# Altium project FMC_SDR_LFFE.PrjPcb (part 3 of 3)

## Sheet CarrierRecovery.SchDoc: Title
size 420 x 297 mm; CheckedBy: -; CompanyName: CERN; DrawnBy: DrawnBy; Organization: CERN; Address1: European Organization for Nuclear Research; Address2: CH-1211 Genčve 23 - Switzerland; DocumentNumber: 1; Revision: -; SheetNumber: 1; SheetTotal: 10; EDA_Number: EDA-XXXXX-VX-X; Projet: -; ModifiedBy: -; CreateDate: XX/XX/XXXX; CheckedDate: -; Title2: Title2; DivGrp: TE/MPE; Designer: Designer; ModifiedDate: -
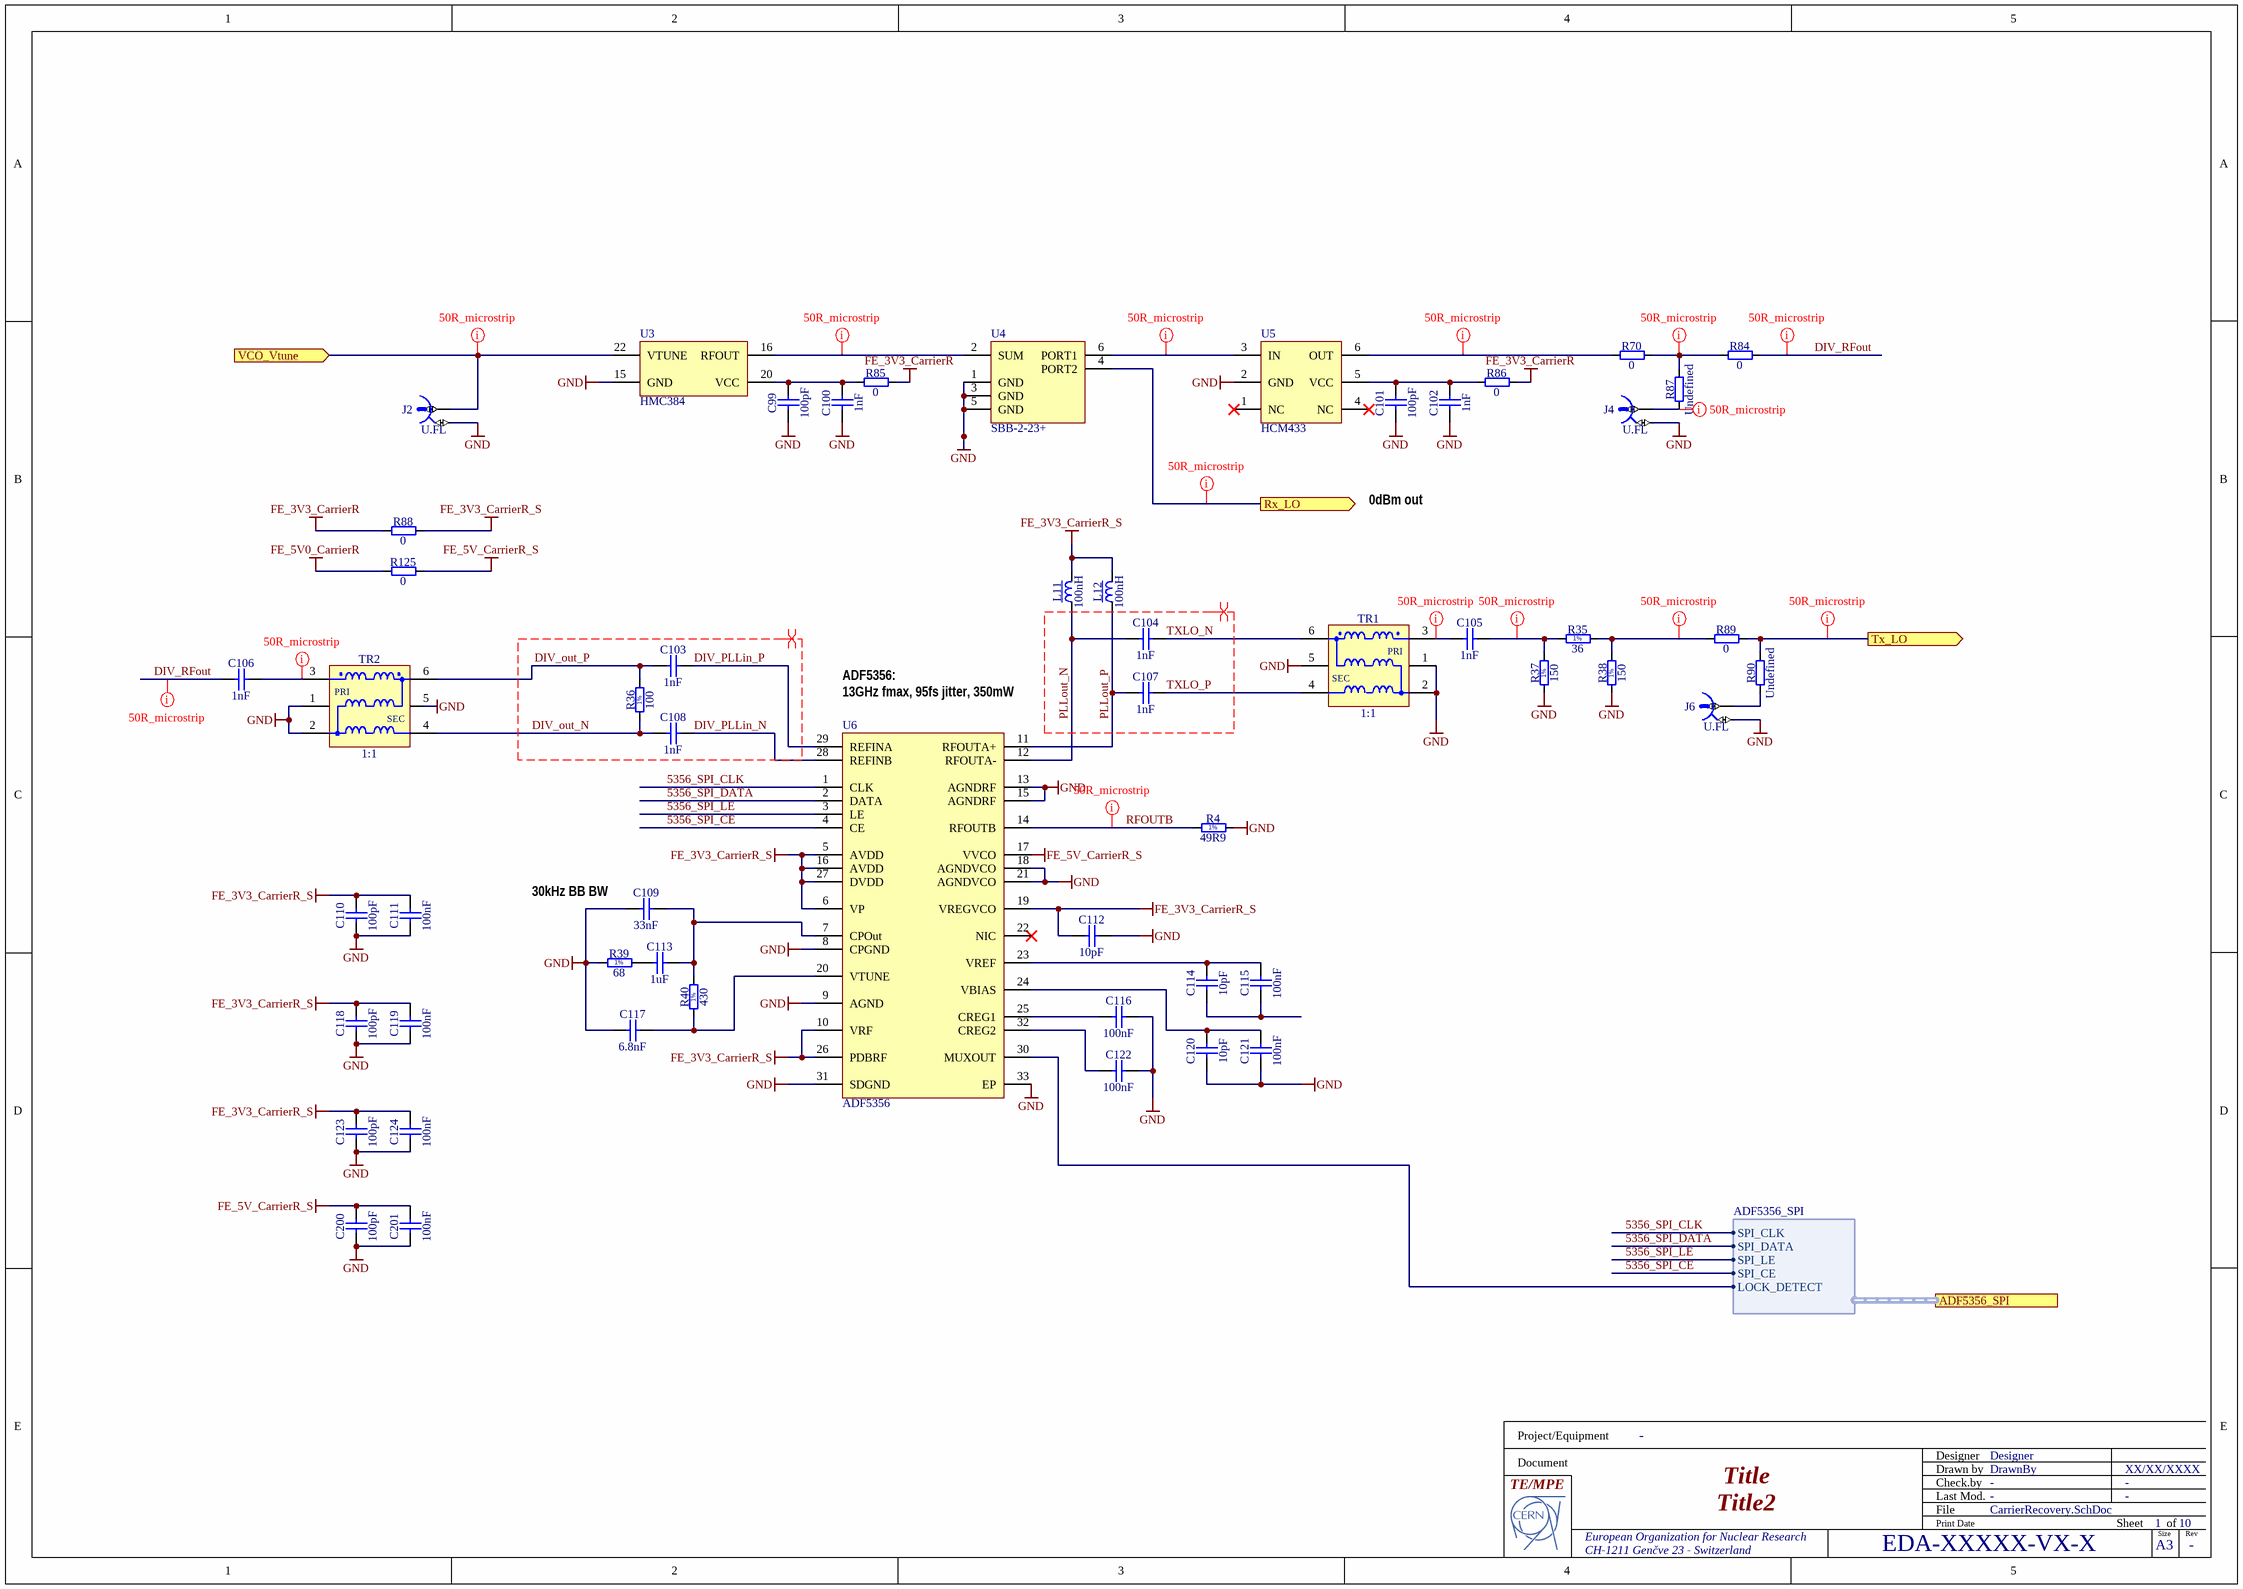
[diagram p9: CarrierRecovery.SchDoc]

### Parts
C99  100pF  [CAPC1005X55N]
C100  1nF  [CAPC1005X55N]
C101  100pF  [CAPC1005X55N]
C102  1nF  [CAPC1005X55N]
C103  1nF  [CAPC1005X55N]
C104  1nF  [CAPC1005X55N]
C105  1nF  [CAPC1005X55N]
C106  1nF  [CAPC1005X55N]
C107  1nF  [CAPC1005X55N]
C108  1nF  [CAPC1005X55N]
C109  33nF  [CAPC2012X135N]
C110  100pF  [CAPC1005X55N]
C111  100nF  [CAPC1005X55N]
C112  10pF  [CAPC1005X55N]
C113  1uF  [CAPC3216X140N]
C114  10pF  [CAPC1005X55N]
C115  100nF  [CAPC1005X55N]
C116  100nF  [CAPC1005X55N]
C117  6.8nF  [CAPC2012X135N]
C118  100pF  [CAPC1005X55N]
C119  100nF  [CAPC1005X55N]
C120  10pF  [CAPC1005X55N]
C121  100nF  [CAPC1005X55N]
C122  100nF  [CAPC1005X55N]
C123  100pF  [CAPC1005X55N]
C124  100nF  [CAPC1005X55N]
C200  100pF  [CAPC1005X55N]
C201  100nF  [CAPC1005X55N]
J2  U.FL  [HIROSE_U.FL-R-SMT-1(10)]
J4  U.FL  [HIROSE_U.FL-R-SMT-1(10)]
J6  U.FL  [HIROSE_U.FL-R-SMT-1(10)]
L11  100nH  [IND_COILCRAFT_0603HP]
L12  100nH  [IND_COILCRAFT_0603HP]
R4  49R9  [RESC1005X40N]
R35  36  [RESC1005X40N]
R36  100  [RESC1005X40N]
R37  150  [RESC1005X40N]
R38  150  [RESC1005X40N]
R39  68  [RESC1608X55N]
R40  430  [RESC1608X55N]
R70  0  [RESC1608X55N]
R84  0  [RESC1608X55N]
R85  0  [RESC1608X55N]
R86  0  [RESC1608X55N]
R87  Undefined  [RESC1608X55N]
R88  0  [RESC1608X55N]
R89  0  [RESC1608X55N]
R90  Undefined  [RESC1608X55N]
R125  0  [RESC1608X55N]
TR1  1:1  [XFMR_MINI-CIRCUITS_DB1627]
TR2  1:1  [XFMR_MINI-CIRCUITS_DB1627]
U3  HMC384  [HMC384]
U4  SBB-2-23+  [SBB-2-23]
U5  HCM433  [HMC433]
U6  ADF5356  [ADF3356]

### Ports
ADF5356_SPI (harness ADF5356_SPI), Rx_LO (out), Tx_LO (out), VCO_Vtune (in)

### Harnesses
ADF5356_SPI: SPI_CLK, SPI_DATA, SPI_LE, SPI_CE, LOCK_DETECT

### Nets
FE_3V3_CarrierR: R85.2 R86.2 R88.1
FE_3V3_CarrierR_S: C110.2 C111.2 C112.1 C118.2 C119.2 C123.2 C124.2 L11.2 L12.2 R88.2 U6.5(AVDD) U6.6(VP) U6.10(VRF) U6.16(AVDD) U6.19(VREGVCO) U6.26(PDBRF) U6.27(DVDD)
FE_5V0_CarrierR: R125.1
FE_5V_CarrierR_S: C200.2 C201.2 R125.2 U6.17(VVCO)
GND: C99.1 C100.1 C101.1 C102.1 C109.1 C110.1 C111.1 C112.2 C116.2 C117.1 C118.1 C119.1 C120.1 C121.1 C122.2 C123.1 C124.1 C200.1 C201.1 J2.2 J4.2 J6.2 R4.2 R37.1 R38.1 R39.1 TR1.1(NC) TR1.2(P1) TR1.5(NC) TR2.1(NC) TR2.2(P1) TR2.5(NC) U3.15(GND) U4.1(GND) U4.3(GND) U4.5(GND) U5.2(GND) U6.8(CPGND) U6.9(AGND) U6.13(AGNDRF) U6.15(AGNDRF) U6.18(AGNDVCO) U6.21(AGNDVCO) U6.31(SDGND) U6.33(EP)
5356_SPI_CE: U6.4(CE) ; port ADF5356_SPI.SPI_CE
5356_SPI_CLK: U6.1(CLK) ; port ADF5356_SPI.SPI_CLK
5356_SPI_DATA: U6.2(DATA) ; port ADF5356_SPI.SPI_DATA
5356_SPI_LE: U6.3(LE) ; port ADF5356_SPI.SPI_LE
DIV_out_N: C108.1 R36.1 TR2.4(S1)
DIV_out_P: C103.1 R36.2 TR2.6(S1)
DIV_PLLin_N: C108.2 U6.28(REFINB)
DIV_PLLin_P: C103.2 U6.29(REFINA)
DIV_RFout: C106.1 R84.2
LOCK_DETECT: U6.30(MUXOUT) ; port ADF5356_SPI.LOCK_DETECT
PLLout_N: C104.1 L11.1 U6.12(RFOUTA-)
PLLout_P: C107.1 L12.1 U6.11(RFOUTA+)
RFOUTB: R4.1 U6.14(RFOUTB)
RX_LO: U4.4(PORT2) ; port Rx_LO
TX_LO: R89.2 R90.2 ; port Tx_LO
TXLO_N: C104.2 TR1.6(S1)
TXLO_P: C107.2 TR1.4(S1)
VCO_Vtune: J2.1 U3.22(VTUNE) ; port VCO_Vtune
NetC99_2: C99.2 C100.2 R85.1 U3.20(VCC)
NetC101_2: C101.2 C102.2 R86.1 U5.5(VCC)
NetC105_1: C105.1 TR1.3(P1)
NetC105_2: C105.2 R35.1 R37.2
NetC106_2: C106.2 TR2.3(P1)
NetC109_2: C109.2 C113.2 R40.2 U6.7(CPOut)
NetC113_1: C113.1 R39.2
NetC114_1: C114.1 C115.1
NetC114_2: C114.2 C115.2 U6.23(VREF)
NetC116_1: C116.1 U6.25(CREG1)
NetC117_2: C117.2 R40.1 U6.20(VTUNE)
NetC120_2: C120.2 C121.2 U6.24(VBIAS)
NetC122_1: C122.1 U6.32(CREG2)
NetJ4_1: J4.1 R87.1
NetJ6_1: J6.1 R90.1
NetR35_2: R35.2 R38.2 R89.1
NetR70_1: R70.1 U5.6(OUT)
NetR70_2: R70.2 R84.1 R87.2
NetU3_16: U3.16(RFOUT) U4.2(SUM)
NetU4_6: U4.6(PORT1) U5.3(IN)

Not connected (* = marked no-connect by the designer): U5 1(NC)* 4(NC)*; U6 22(NIC)*

### Layout directives
net class 50R_class: DIV_RFout, NetC105_1, NetC105_2, NetC106_2, NetJ4_1, NetR35_2, NetR70_1, NetR70_2, NetU3_16, NetU4_6, RFOUTB, RX_LO, TX_LO, VCO_Vtune
differential pair; differential pair class 100R_diff: DIV_out_N, DIV_out_P, DIV_PLLin_N, DIV_PLLin_P, PLLout_N, PLLout_P, TXLO_N, TXLO_P

### Notes on the sheet
- 0dBm out
- (near R35) -6dB
- (near U6) ADF5356:
  13GHz fmax, 95fs jitter, 350mW
- (near C109) 30kHz BB BW
- Project/Equipment
- Document
- Designer
- Drawn by
- Check.by
- File
- Last Mod.
- Print Date
- Sheet
- Size
- A3
- of
- Rev
- (in symbol R0402_36R_1%_0.0625W_100PPM) 1%
- (in symbol R0402_49R9_1%_0.0625W_100PPM) 1%
- (in symbol R0402_100R_1%_0.0625W_100PPM) 1%
- (in symbol R0402_150R_1%_0.0625W_100PPM) 1%
- (in symbol R0603_68R_1%_0.1W_100PPM) 1%
- (in symbol R0603_430R_1%_0.1W_100PPM) 1%
- (in symbol XFMR_MINI-CIRCUITS_TCM1-63AX+) PRI; SEC

### Library data of the parts
C99 C101 C110 C118 C123 C200 = CC0402_100PF_50V_5%_C0G: Non-polarised capacitor; Part Description: SMD Multilayer Chip Ceramic Capacitor; Manufacturer: GENERIC; Manufacturer1 Part Number: C0402C101J5GACTU; Voltage: 50V; TC: C0G/NP0; Tolerance: ±5%; Part Number: CC0402_100PF_50V_5%_C0G; Component Kind: Standard; Component Type: Standard; Pin Count: 2; Value: 100pF; Status: Preferred; Manufacturer Part Number: CC0402_100PF_50V_5%_C0G; Case: 0402; Mounted: Yes; Socket: No; SMD: Yes; Sense: No; Manufacturer1 Example: KEMET; Manufacturer1 ComponentHeight: 0.55mm; HelpURL: \\cern.ch\dfs\Applications\Altium\Datasheets\CC0805_C0G_KEMET_(Commercial Grade).pdf; Author: CERN DEM JLC; CreateDate: 03.12.2007; LatestRevisionDate: 22.04.2015
C100 C102-C108 = CC0402_1NF_50V_10%_X7R: Non-polarised capacitor; Part Description: SMD Multilayer Chip Ceramic Capacitor; Manufacturer: GENERIC; Manufacturer1 Part Number: 223858715623; Voltage: 50V; TC: X7R; Tolerance: ±10%; Part Number: CC0402_1NF_50V_10%_X7R; Component Kind: Standard; Component Type: Standard; Pin Count: 2; Value: 1nF; Status: Not Recommended; Manufacturer Part Number: CC0402_1NF_50V_10%_X7R; Case: 0402; Mounted: Yes; Socket: No; SMD: Yes; Sense: No; Manufacturer1 Example: PHYCOMP; Manufacturer1 ComponentHeight: 0.55mm; HelpURL: \\cern.ch\dfs\Applications\Altium\Datasheets\CC0402_X7R_PHYCOMP.pdf; Author: CERN DEM JLC; CreateDate: 03.12.2007; LatestRevisionDate: 03.12.2007
C109 = CC0805_33NF_25V_10%_X7R: Non-polarised capacitor; Part Description: SMD Multilayer Chip Ceramic Capacitor; Manufacturer: GENERIC; Manufacturer1 Part Number: 223891015643; Voltage: 25V; TC: X7R; Tolerance: ±10%; Part Number: CC0805_33NF_25V_10%_X7R; Component Kind: Standard; Component Type: Standard; Pin Count: 2; Value: 33nF; Status: Preferred; Manufacturer Part Number: CC0805_33NF_25V_10%_X7R; Case: 0805; Mounted: Yes; Socket: No; SMD: Yes; Sense: No; Manufacturer1 Example: PHYCOMP; Manufacturer1 ComponentHeight: 1.35mm; HelpURL: \\cern.ch\dfs\Applications\Altium\Datasheets\CC0805_X7R_PHYCOMP.pdf; Author: CERN DEM JLC; CreateDate: 03.12.2007; LatestRevisionDate: 03.12.2007
C111 C115 C116 C119 C121 C122 C124 C201 = CC0402_100NF_50V_10%_X7R: Non-polarised capacitor; Part Description: SMD Multilayer Chip Ceramic Capacitor; Manufacturer: GENERIC; Manufacturer1 Part Number: GRM155R71H104KE14D; Voltage: 50V; TC: X7R; Tolerance: ±10%; Part Number: CC0402_100NF_50V_10%_X7R; Component Kind: Standard; Component Type: Standard; Pin Count: 2; Value: 100nF; Status: None; Manufacturer Part Number: CC0402_100NF_50V_10%_X7R; Case: 0402; Mounted: Yes; Socket: No; SMD: Yes; Sense: No; Manufacturer1 Example: MURATA; Manufacturer1 ComponentHeight: 0.55mm; HelpURL: \\cern.ch\dfs\Applications\Altium\Datasheets\CC0402_MURATA_GRM155R71H104KE14D.pdf; Author: CERN DEM MR; CreateDate: 30.06.2017; LatestRevisionDate: 30.06.2017
C112 C114 C120 = CC0402_10PF_50V_5%_C0G: Non-polarised capacitor; Part Description: SMD Multilayer Chip Ceramic Capacitor; Manufacturer: GENERIC; Manufacturer1 Part Number: C0402C100J5GACTU; Voltage: 50V; TC: C0G/NP0; Tolerance: ±5%; Part Number: CC0402_10PF_50V_5%_C0G; Component Kind: Standard; Component Type: Standard; Pin Count: 2; Value: 10pF; Status: Preferred; Manufacturer Part Number: CC0402_10PF_50V_5%_C0G; Case: 0402; Mounted: Yes; Socket: No; SMD: Yes; Sense: No; Manufacturer1 Example: KEMET; Manufacturer1 ComponentHeight: 0.55mm; HelpURL: \\cern.ch\dfs\Applications\Altium\Datasheets\CC0805_C0G_KEMET_(Commercial Grade).pdf; Author: CERN DEM JLC; CreateDate: 03.12.2007; LatestRevisionDate: 22.04.2015
C113 = CC1206_1UF_25V_10%_X7R: Non-polarised capacitor; Part Description: SMD Multilayer Chip Ceramic Capacitor; Manufacturer: GENERIC; Manufacturer1 Part Number: C1206C105K3RAC; Voltage: 25V; TC: X7R; Tolerance: ±10%; Part Number: CC1206_1UF_25V_10%_X7R; Component Kind: Standard; Component Type: Standard; Pin Count: 2; Value: 1uF; Status: Preferred; Manufacturer Part Number: CC1206_1UF_25V_10%_X7R; Case: 1206; Mounted: Yes; Socket: No; SMD: Yes; Sense: No; Manufacturer1 Example: KEMET; Manufacturer1 ComponentHeight: 1.75mm; HelpURL: \\cern.ch\dfs\Applications\Altium\Datasheets\CC1206_X7R_KEMET.pdf; Author: CERN DEM JLC; CreateDate: 03.12.2007; LatestRevisionDate: 03.12.2007
C117 = CC0805_6.8NF_50V_10%_X7R: Non-polarised capacitor; Part Description: SMD Multilayer Chip Ceramic Capacitor; Manufacturer: GENERIC; Manufacturer1 Part Number: 223858615634; Voltage: 50V; TC: X7R; Tolerance: ±10%; Part Number: CC0805_6.8NF_50V_10%_X7R; Component Kind: Standard; Component Type: Standard; Pin Count: 2; Value: 6.8nF; Status: Preferred; Manufacturer Part Number: CC0805_6.8NF_50V_10%_X7R; Case: 0805; Mounted: Yes; Socket: No; SMD: Yes; Sense: No; Manufacturer1 Example: PHYCOMP; Manufacturer1 ComponentHeight: 1.35mm; HelpURL: \\cern.ch\dfs\Applications\Altium\Datasheets\CC0805_X7R_PHYCOMP.pdf; Author: CERN DEM JLC; CreateDate: 03.12.2007; LatestRevisionDate: 03.12.2007
J2 J4 J6 = HIROSE_U.FL-R-SMT-1(10): Part Description: Up to 6GHz Ultra Small Surface Mount Male Coaxial Connectors U.FL Series; Manufacturer: HIROSE (HRS); PressFit: No; Part Number: HIROSE_U.FL-R-SMT-1(10); Component Kind: Standard; Component Type: Standard; Pin Count: 2; Family: U.FL; Mounted: Yes; Socket: No; SMD: Yes; Sense: No; Status: None; Manufacturer Part Number: U.FL-R-SMT-1(10); ComponentHeight: 1.25mm; HelpURL: \\cern.ch\dfs\Applications\Altium\Datasheets\HIROSE_U.FL-R-SMT-1(10).pdf; Author: CERN DEM JLC; CreateDate: 24.03.2010; LatestRevisionDate: 24.03.2010
L11 L12 = IND0603_100NH_2%_COILCRAFT_0603HP-R10XGLU: Inductor With Core; Part Description: Ceramic Chip Inductor; Power: 470mA; Resistance: 0.54R; Tolerance: ±2%; Part Number: IND0603_100NH_2%_COILCRAFT_0603HP-R10XGLU; Component Kind: Standard; Component Type: Standard; Pin Count: 2; Value: 100nH; Status: None; Manufacturer: COILCRAFT; Manufacturer Part Number: 0603HP-R10XGLU; Case: 0603; Mounted: Yes; Socket: No; SMD: Yes; Sense: No; ComponentHeight: 0.94mm; HelpURL: \\cern.ch\dfs\Applications\Altium\Datasheets\IND0603_COILCRAFT_0603HP.pdf; Author: CERN DEM JLC; CreateDate: 09.02.2017; LatestRevisionDate: 09.02.2017
R4 = R0402_49R9_1%_0.0625W_100PPM: Resistor - 1%; Part Description: General Purpose Thick Film Chip Resistor; Manufacturer: GENERIC; Manufacturer1 Part Number: 232270674999L or RC0402FR-0749R9L; TC: ±100ppm/°C; PressFit: No; Part Number: R0402_49R9_1%_0.0625W_100PPM; Component Kind: Standard; Component Type: Standard; Pin Count: 2; Value: 49R9; Status: Not Recommended; Power: 0.0625W; Tolerance: ±1%; Manufacturer Part Number: R0402_49R9_1%_0.0625W_100PPM; Case: 0402; Mounted: Yes; Sense: No; Socket: No; SMD: Yes; Manufacturer1 Example: YAGEO PHYCOMP; Manufacturer1 ComponentHeight: 0.4mm; HelpURL: \\cern.ch\dfs\Applications\Altium\Datasheets\R0402_Phycomp_RC0402.pdf; Author: CERN DEM JLC; CreateDate: 24.10.2012; LatestRevisionDate: 24.10.2012
R35 = R0402_36R_1%_0.0625W_100PPM: Resistor - 1%; Part Description: General Purpose Thick Film Chip Resistor; Manufacturer: GENERIC; Manufacturer1 Part Number: 232270673609L; TC: ±100ppm/°C; PressFit: No; Part Number: R0402_36R_1%_0.0625W_100PPM; Component Kind: Standard; Component Type: Standard; Pin Count: 2; Value: 36; Status: Not Recommended; Power: 0.0625W; Tolerance: ±1%; Manufacturer Part Number: R0402_36R_1%_0.0625W_100PPM; Case: 0402; Mounted: Yes; Sense: No; Socket: No; SMD: Yes; Manufacturer1 Example: YAGEO PHYCOMP; Manufacturer1 ComponentHeight: 0.4mm; HelpURL: \\cern.ch\dfs\Applications\Altium\Datasheets\R0402_Phycomp_RC0402.pdf; Author: CERN DEM JLC; CreateDate: 03.12.2007; LatestRevisionDate: 17.10.2012
R36 = R0402_100R_1%_0.0625W_100PPM: Resistor - 1%; Part Description: General Purpose Thick Film Chip Resistor; Manufacturer: GENERIC; Manufacturer1 Part Number: 232270671001L; TC: ±100ppm/°C; PressFit: No; Part Number: R0402_100R_1%_0.0625W_100PPM; Component Kind: Standard; Component Type: Standard; Pin Count: 2; Value: 100; Status: Not Recommended; Power: 0.0625W; Tolerance: ±1%; Manufacturer Part Number: R0402_100R_1%_0.0625W_100PPM; Case: 0402; Mounted: Yes; Sense: No; Socket: No; SMD: Yes; Manufacturer1 Example: YAGEO PHYCOMP; Manufacturer1 ComponentHeight: 0.4mm; HelpURL: \\cern.ch\dfs\Applications\Altium\Datasheets\R0402_Phycomp_RC0402.pdf; Author: CERN DEM JLC; CreateDate: 03.12.2007; LatestRevisionDate: 17.10.2012
R37 R38 = R0402_150R_1%_0.0625W_100PPM: Resistor - 1%; Part Description: General Purpose Thick Film Chip Resistor; Manufacturer: GENERIC; Manufacturer1 Part Number: 232270671501L; TC: ±100ppm/°C; PressFit: No; Part Number: R0402_150R_1%_0.0625W_100PPM; Component Kind: Standard; Component Type: Standard; Pin Count: 2; Value: 150; Status: Not Recommended; Power: 0.0625W; Tolerance: ±1%; Manufacturer Part Number: R0402_150R_1%_0.0625W_100PPM; Case: 0402; Mounted: Yes; Sense: No; Socket: No; SMD: Yes; Manufacturer1 Example: YAGEO PHYCOMP; Manufacturer1 ComponentHeight: 0.4mm; HelpURL: \\cern.ch\dfs\Applications\Altium\Datasheets\R0402_Phycomp_RC0402.pdf; Author: CERN DEM JLC; CreateDate: 03.12.2007; LatestRevisionDate: 17.10.2012
R39 = R0603_68R_1%_0.1W_100PPM: Resistor - 1%; Part Description: General Purpose Thick Film Chip Resistor; Manufacturer: GENERIC; Manufacturer1 Part Number: NRC06F68R0TRF; Power: 0.1W; TC: ±100ppm/°C; PressFit: No; Part Number: R0603_68R_1%_0.1W_100PPM; Component Kind: Standard; Component Type: Standard; Pin Count: 2; Value: 68; Status: Preferred; Tolerance: ±1%; Manufacturer Part Number: R0603_68R_1%_0.1W_100PPM; Case: 0603; Mounted: Yes; Sense: No; Socket: No; SMD: Yes; Manufacturer1 Example: NIC COMPONENT; Manufacturer1 ComponentHeight: 0.55mm; HelpURL: \\cern.ch\dfs\Applications\Altium\Datasheets\R0603_NIC_NRC.pdf; Author: CERN DEM JLC; CreateDate: 03.12.2007; LatestRevisionDate: 13.03.2008
R40 = R0603_430R_1%_0.1W_100PPM: Resistor - 1%; Part Description: General Purpose Thick Film Chip Resistor; Manufacturer: GENERIC; Manufacturer1 Part Number: NRC06F4300TRF; Power: 0.1W; TC: ±100ppm/°C; PressFit: No; Part Number: R0603_430R_1%_0.1W_100PPM; Component Kind: Standard; Component Type: Standard; Pin Count: 2; Value: 430; Status: Preferred; Tolerance: ±1%; Manufacturer Part Number: R0603_430R_1%_0.1W_100PPM; Case: 0603; Mounted: Yes; Sense: No; Socket: No; SMD: Yes; Manufacturer1 Example: NIC COMPONENT; Manufacturer1 ComponentHeight: 0.55mm; HelpURL: \\cern.ch\dfs\Applications\Altium\Datasheets\R0603_NIC_NRC.pdf; Author: CERN DEM JLC; CreateDate: 03.12.2007; LatestRevisionDate: 13.03.2008
R70 R84-R86 R88 R89 R125 = R0603_0R_JUMPER: Resistor; Part Description: 1A (0.05R Max DC Resistance) Zero Ohm Jumper; Manufacturer: GENERIC; Manufacturer1 Part Number: NRC06Z0; PressFit: No; Part Number: R0603_0R_JUMPER; Component Kind: Standard; Component Type: Standard; Pin Count: 2; Value: 0; Status: Preferred; Manufacturer Part Number: R0603_0R_JUMPER; Case: 0603; Mounted: Yes; Sense: No; Socket: No; SMD: Yes; Manufacturer1 Example: NIC COMPONENT; Manufacturer1 ComponentHeight: 0.55mm; HelpURL: \\cern.ch\dfs\Applications\Altium\Datasheets\R0603_NIC_NRC.pdf; Author: CERN DEM JLC; CreateDate: 03.12.2007; LatestRevisionDate: 13.03.2008
R87 R90 = R0603_NO-VALUE: Resistor; Part Description: Reserved Footprint For a 0603 (1608) Chip Resistor; PressFit: No; Mounted: No; Part Number: R0603_NO-VALUE; Component Kind: Standard; Component Type: Standard; Pin Count: 2; Value: Undefined; Status: None; Manufacturer: Undefined; Manufacturer Part Number: R0603_NO-VALUE; Case: 0603; Sense: No; Socket: No; SMD: Yes; Manufacturer1 Example: Undefined; Manufacturer1 Part Number: Undefined; Manufacturer1 ComponentHeight: Undefined; HelpURL: Undefined; Author: CERN DEM JLC; CreateDate: 03.12.2007; LatestRevisionDate: 13.03.2008
TR1 TR2 = XFMR_MINI-CIRCUITS_TCM1-63AX+: 50 Ohms 10  to 6000MHz RF Transformer; Power: 0.2W; Part Number: XFMR_MINI-CIRCUITS_TCM1-63AX+; Component Kind: Standard; Component Type: Standard; Pin Count: 6; Value: 1:1; Status: None; Part Description: 50 Ohms 10  to 6000MHz RF Transformer; Manufacturer: MINI-CIRCUITS; Manufacturer Part Number: TCM1-63AX+; Mounted: Yes; Socket: No; Sense: No; SMD: Yes; ComponentHeight: 4.06mm; HelpURL: \\cern.ch\dfs\Applications\Altium\Datasheets\XFMR_MINI-CIRCUITS_TCM1-63AX+.pdf; Author: CERN DEM MR; CreateDate: 08.02.2019; LatestRevisionDate: 08.02.2019

## Nets that join several sheets
FE_3V3_CarrierR: FrontEnd_PS (C130.2 R91.1 R96.2), CarrierRecovery (R85.2 R86.2 R88.1)
FE_3V3_Rx: FrontEnd_PS (C139.2 R99.1 R101.2), QPL9065 (R3.1 R61.1 R63.1)
FE_3V3_SW: FrontEnd (C13.2 C14.2 OSC1.4), FrontEnd_PS (C189.2 R102.1 R107.2), TDDswitches (6 pins)
FE_5V0_CarrierR: FrontEnd_PS (R147.2), CarrierRecovery (R125.1)
FE_5V0_Preamp: FrontEnd_PS (R115.2), TXpreamp (C174.2 C175.2 C176.2 L23.2)
FE_5V5: FrontEnd_PS (5 pins), LTM8032_5V5 (17 pins)
FE_PA_BIAS: FrontEnd_PS (R105.2), TGA2237orHMC453 (R73.1)
FE_PA_VDD: LTM8056 (22 pins), TGA2237orHMC453 (R77.2 R82.2)
FMC_3V3_IN: FrontEnd (BSC18.1), FrontEnd_PS (6 pins)
FMC_12V_IN: FrontEnd (BSC19.1), FrontEnd_PS (R103.1 R126.1)
GND: FrontEnd (17 pins), FrontEnd_PS (21 pins), LTM8032_5V5 (46 pins), LTM8032_3V8 (46 pins), QPL9065 (12 pins), TGA2237orHMC453 (14 pins), TXpreamp (C174.1 C175.1 C176.1 U12.2), TDDswitches (20 pins), CarrierRecovery (45 pins)
PA_GND: FrontEnd_PS (20 pins), LTM8056 (89 pins), QPL9065 (J8.2 J9.2), TGA2237orHMC453 (24 pins)
5356_SPI_CE: FrontEnd (BSC13.1), CarrierRecovery (U6.4)
5356_SPI_CLK: FrontEnd (BSC8.1), CarrierRecovery (U6.1)
5356_SPI_DATA: FrontEnd (BSC10.1), CarrierRecovery (U6.2)
5356_SPI_LE: FrontEnd (BSC11.1), CarrierRecovery (U6.3)
CR_NSHDN: FrontEnd (BSC12.1), FrontEnd_PS (R131.1 R149.1)
FE_NSHDN_DEEP: FrontEnd (BSC17.1), FrontEnd_PS (R129.1)
FE_TxAmpCPL: FrontEnd (R41.1 R43.2), TGA2237orHMC453 (IC6.3)
LNA_PD: FrontEnd (BSC15.1), QPL9065 (R49.1)
LOCK_DETECT: FrontEnd (BSC20.1), CarrierRecovery (U6.30)
NetC1_2: FrontEnd_PS (R95.2), LTM8032_3V8 (7 pins)
NetC3_2: FrontEnd_PS (R98.1), LTM8032_3V8 (17 pins)
NetC10_2: FrontEnd_PS (R126.2 R127.2), LTM8032_5V5 (7 pins)
NetC16_1: FrontEnd (FL2.3), TGA2237orHMC453 (C16.1 R34.1)
NetC156_1: FrontEnd (J1.1), TDDswitches (C156.1 R64.1)
NetC157_2: FrontEnd (FL1.3), TDDswitches (C157.2 R33.1)
NetC158_2: FrontEnd (R46.2), TDDswitches (C158.2)
NetC178_2: FrontEnd (FL2.1), TXpreamp (C178.2)
NetFL1_1: FrontEnd (FL1.1), TGA2237orHMC453 (IC6.6)
NetFL4_1: FrontEnd (FL4.1), QPL9065 (R28.2)
NetIC2_L4: FrontEnd_PS (R150.2), LTM8056 (IC2.L4)
NetIC3_L5: FrontEnd_PS (R129.2), LTM8032_5V5 (IC3.L5 R6.1)
NetIC9_4: FrontEnd (IC9.4), QPL9065 (R27.1)
PA_PS_IN: FrontEnd_PS (7 pins), LTM8056 (17 pins)
RX_LO: FrontEnd (BSC7.1), CarrierRecovery (U4.4)
SYNC_DCDC: FrontEnd (BSC21.1), LTM8032_5V5 (R50.1), LTM8032_3V8 (R52.1), LTM8056 (R51.1)
TX_IN: FrontEnd (BSC1.1), TXpreamp (C177.1)
TX_LO: FrontEnd (BSC9.1), CarrierRecovery (R89.2 R90.2)
TX_SHDN: FrontEnd (BSC16.1), FrontEnd_PS (IC14.3 R144.1)
TXNRX: FrontEnd (BSC4.1), TDDswitches (IC15.7 IC16.7)
VCO_Vtune: FrontEnd (BSC14.1), CarrierRecovery (J2.1 U3.22)